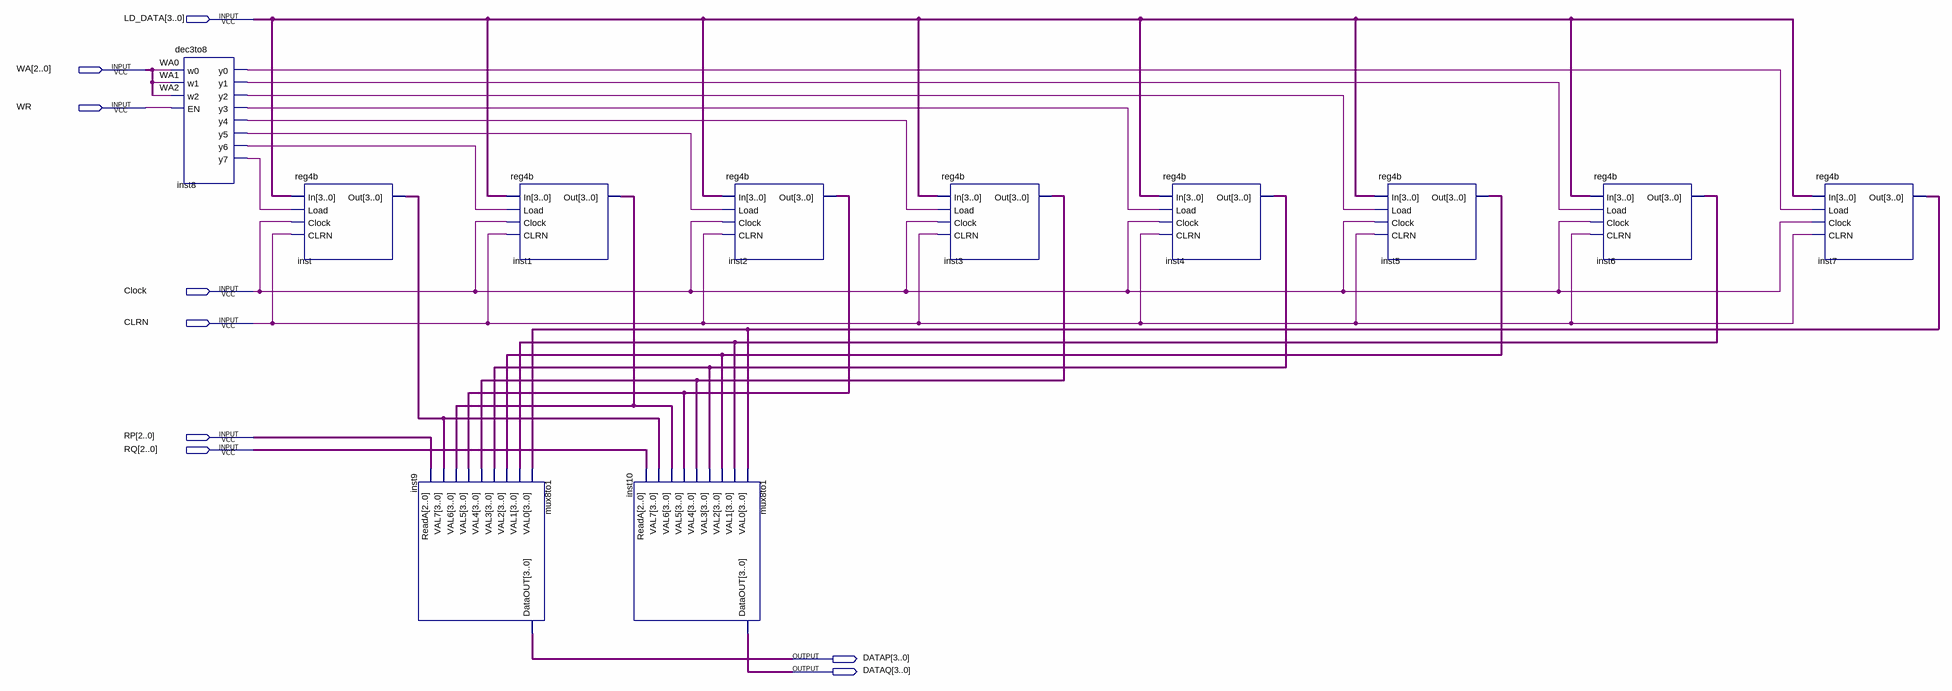
[diagram p0: schematic sheet]
// Quartus schematic regfile.bdf as structural Verilog: 11 symbols, 9 pins
module regfile (
  input  [3:0] LD_DATA,
  input  [2:0] WA,
  input  WR,
  input  Clock,
  input  CLRN,
  input  [2:0] RP,
  input  [2:0] RQ,
  output [3:0] DATAP,
  output [3:0] DATAQ
);

  wire inst8_y0, inst8_y1, inst8_y2, inst8_y3, inst8_y4, inst8_y5, inst8_y6, inst8_y7;
  wire [3:0] inst1_out, inst2_out, inst3_out, inst4_out, inst5_out, inst6_out, inst7_out, inst_out;

  dec3to8 inst8 (
    .w0(WA[0]), .w1(WA[1]), .w2(WA[2]), .EN(WR), .y0(inst8_y0), .y1(inst8_y1), .y2(inst8_y2), .y3(inst8_y3),
    .y4(inst8_y4), .y5(inst8_y5), .y6(inst8_y6), .y7(inst8_y7));
  reg4b inst (.In(LD_DATA), .Load(inst8_y7), .Clock(Clock), .CLRN(CLRN), .Out(inst_out));
  mux8to1 inst9 (
    .VAL0(inst7_out), .VAL1(inst6_out), .VAL2(inst5_out), .VAL3(inst4_out), .VAL4(inst3_out),
    .VAL5(inst2_out), .VAL6(inst1_out), .VAL7(inst_out), .ReadA(RP), .DataOUT(DATAP));
  reg4b inst1 (.In(LD_DATA), .Load(inst8_y6), .Clock(Clock), .CLRN(CLRN), .Out(inst1_out));
  mux8to1 inst10 (
    .VAL0(inst7_out), .VAL1(inst6_out), .VAL2(inst5_out), .VAL3(inst4_out), .VAL4(inst3_out),
    .VAL5(inst2_out), .VAL6(inst1_out), .VAL7(inst_out), .ReadA(RQ), .DataOUT(DATAQ));
  reg4b inst2 (.In(LD_DATA), .Load(inst8_y5), .Clock(Clock), .CLRN(CLRN), .Out(inst2_out));
  reg4b inst3 (.In(LD_DATA), .Load(inst8_y4), .Clock(Clock), .CLRN(CLRN), .Out(inst3_out));
  reg4b inst4 (.In(LD_DATA), .Load(inst8_y3), .Clock(Clock), .CLRN(CLRN), .Out(inst4_out));
  reg4b inst5 (.In(LD_DATA), .Load(inst8_y2), .Clock(Clock), .CLRN(CLRN), .Out(inst5_out));
  reg4b inst6 (.In(LD_DATA), .Load(inst8_y1), .Clock(Clock), .CLRN(CLRN), .Out(inst6_out));
  reg4b inst7 (.In(LD_DATA), .Load(inst8_y0), .Clock(Clock), .CLRN(CLRN), .Out(inst7_out));
endmodule
